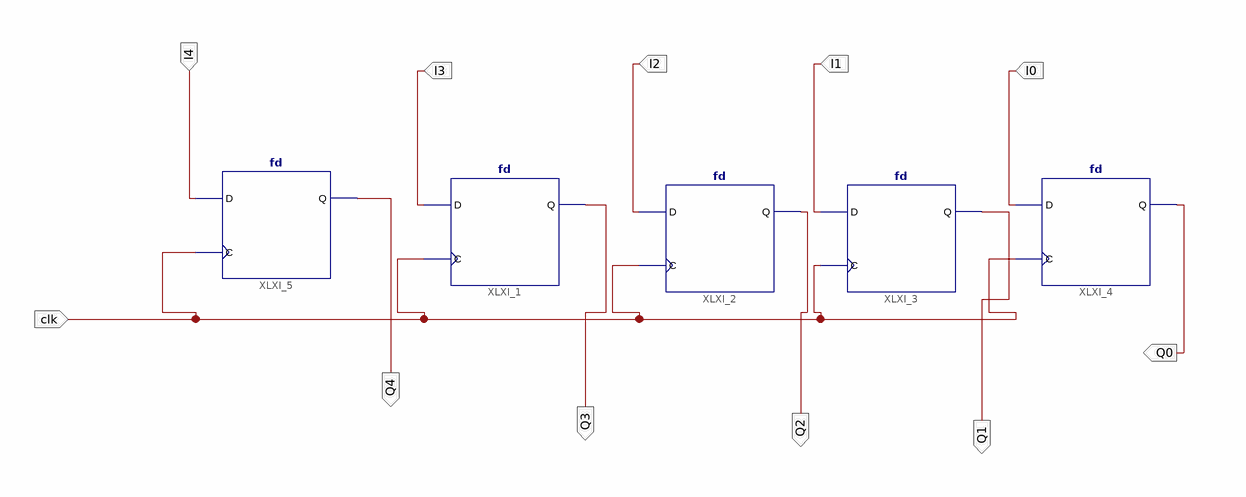
[diagram p0: schematic sheet 1]
// Xilinx ISE schematic five_bit_register.sch (spartan3e) as structural Verilog: 5 symbols, 11 ports
module five_bit_register (
  input  I4,
  input  I3,
  input  I2,
  input  I1,
  input  I0,
  input  clk,
  output Q4,
  output Q0,
  output Q3,
  output Q2,
  output Q1
);

  fd XLXI_1 (.C(clk), .D(I3), .Q(Q3));
  fd XLXI_2 (.C(clk), .D(I2), .Q(Q2));
  fd XLXI_3 (.C(clk), .D(I1), .Q(Q1));
  fd XLXI_4 (.C(clk), .D(I0), .Q(Q0));
  fd XLXI_5 (.C(clk), .D(I4), .Q(Q4));
endmodule
